# Altium schematic sheet HDMI2.0.SchDoc
size A4
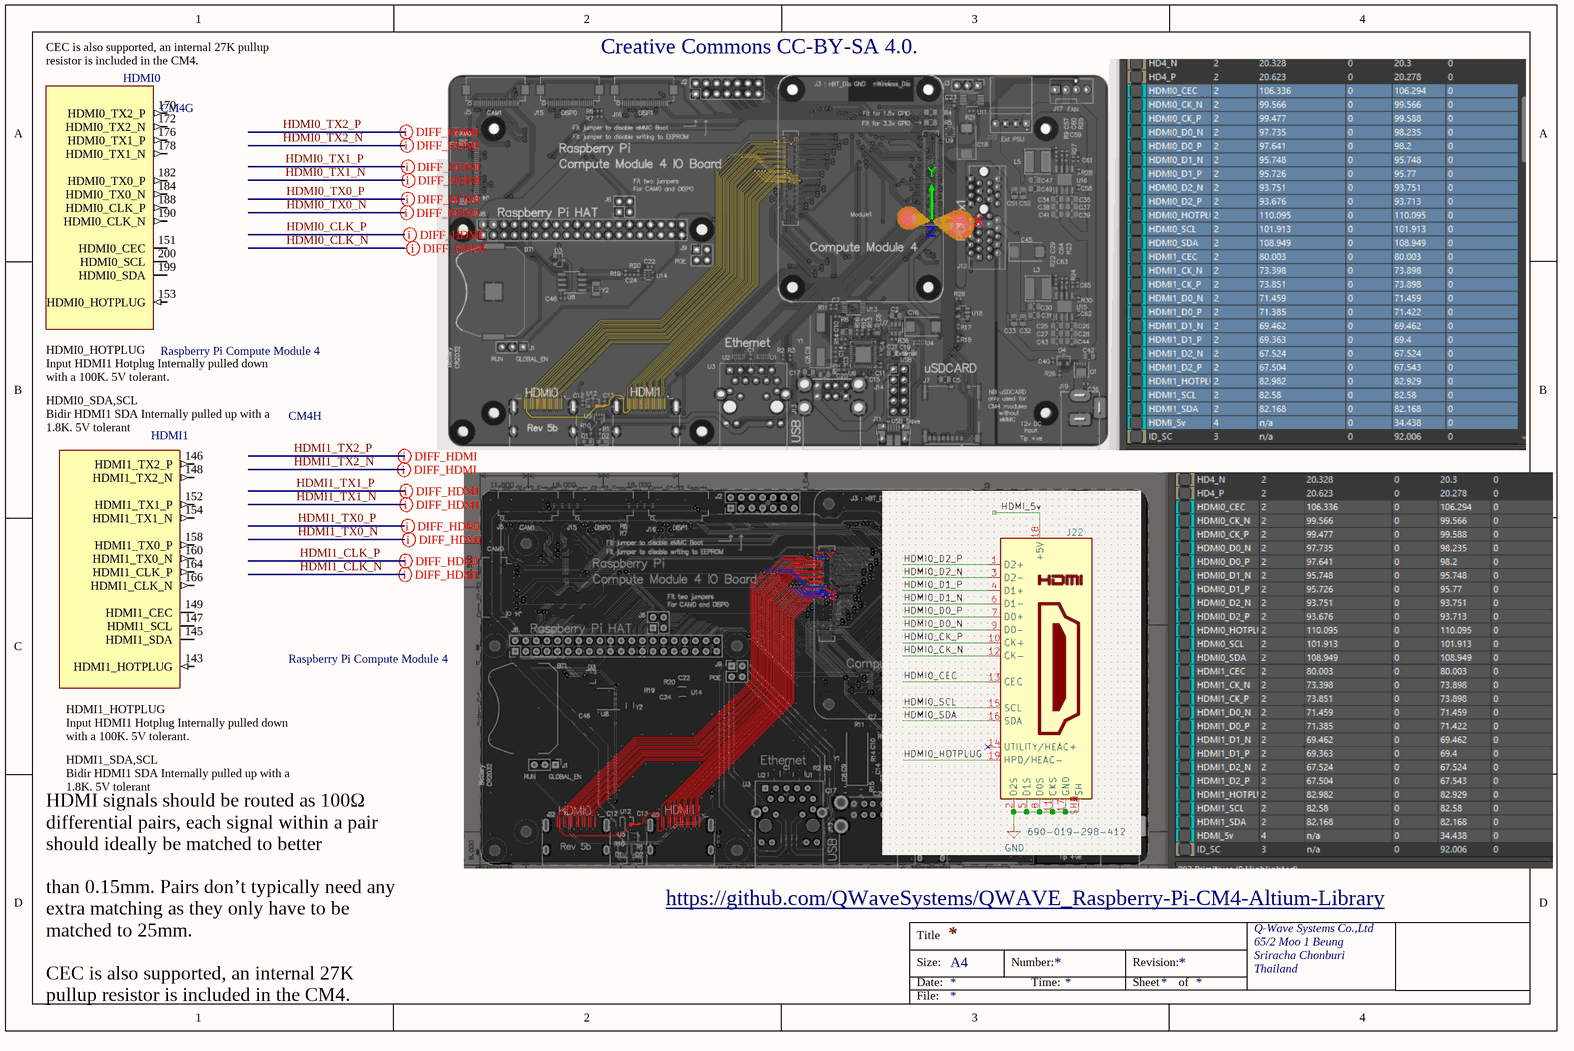
[diagram p0: HDMI2.0.SchDoc]

## Parts
CM4  Raspberry Pi Compute Module 4  [CM4-F40C-100DS-0.4v_1.5mm_0mm]  (parts G,H of 21)  (no BOM)

## Nets

Not connected (* = marked no-connect by the designer): CM4 143(HDMI1_HOTPLUG) 145(HDMI1_SDA) 146(HDMI1_TX2_P) 147(HDMI1_SCL) 148(HDMI1_TX2_N) 149(HDMI1_CEC) 151(HDMI0_CEC) 152(HDMI1_TX1_P) 153(HDMI0_HOTPLUG) 154(HDMI1_TX1_N) 158(HDMI1_TX0_P) 160(HDMI1_TX0_N) 164(HDMI1_CLK_P) 166(HDMI1_CLK_N) 170(HDMI0_TX2_P) 172(HDMI0_TX2_N) 176(HDMI0_TX1_P) 178(HDMI0_TX1_N) 182(HDMI0_TX0_P) 184(HDMI0_TX0_N) 188(HDMI0_CLK_P) 190(HDMI0_CLK_N) 199(HDMI0_SDA) 200(HDMI0_SCL)

## Layout directives
differential pair; differential pair class DIFF_100Ohm_HDMI; differential pair class DIFF_HDMI; net class HDMI_18Gbps: HDMI0_CLK_N, HDMI0_CLK_P, HDMI0_TX0_N, HDMI0_TX0_P, HDMI0_TX1_N, HDMI0_TX1_P, HDMI0_TX2_N, HDMI0_TX2_P, HDMI1_CLK_N, HDMI1_CLK_P, HDMI1_TX0_N, HDMI1_TX0_P, HDMI1_TX1_N, HDMI1_TX1_P, HDMI1_TX2_N, HDMI1_TX2_P

## Notes on the sheet
- Creative Commons CC-BY-SA 4.0.
- https://github.com/QWaveSystems/QWAVE_Raspberry-Pi-CM4-Altium-Library
- HDMI signals should be routed as 100Ω differential pairs, each signal within a pair should ideally be matched to better
  than 0.15mm. Pairs don’t typically need any extra matching as they only have to be matched to 25mm.
  CEC is also supported, an internal 27K pullup resistor is included in the CM4.
- Title
- Size:
- Date:
- A4
- Number:
- Time:
- Revision:
- Sheet
- of
- Q-Wave Systems Co.,Ltd
- 65/2 Moo 1 Beung
- Sriracha Chonburi
- Thailand
- File:
- (in symbol CM4, part G) HDMI0; CEC is also supported, an internal 27K pullup resistor is included in the CM4.; HDMI0_HOTPLUG / Input HDMI1 Hotplug Internally pulled down with a 100K. 5V tolerant.; HDMI0_SDA,SCL / Bidir HDMI1 SDA Internally pulled up with a 1.8K. 5V tolerant
- (in symbol CM4, part H) HDMI1; HDMI1_HOTPLUG / Input HDMI1 Hotplug Internally pulled down with a 100K. 5V tolerant.; HDMI1_SDA,SCL / Bidir HDMI1 SDA Internally pulled up with a 1.8K. 5V tolerant

## Library data of the parts
CM4 = CM4: Raspberry Pi Compute Module 4 by Amornthep Phunsin